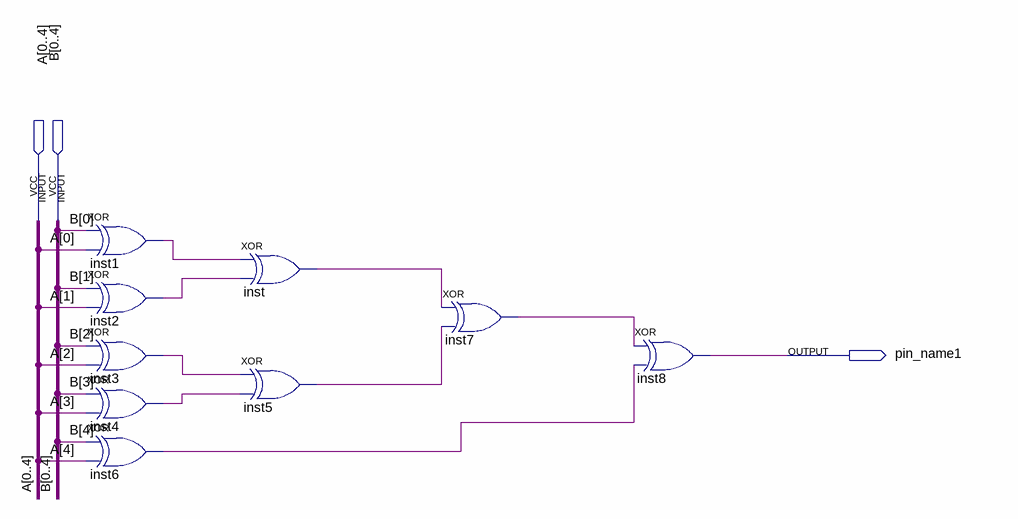
[diagram p0: schematic sheet]
// Quartus schematic AXORB.bdf as structural Verilog: 9 symbols, 3 pins
module AXORB (
  input  [0:4] A,
  input  [0:4] B,
  output pin_name1
);

  wire inst1_out, inst2_out, inst3_out, inst4_out, inst5_out, inst6_out, inst7_out, inst_out;

  xor inst1 (inst1_out, B[0], A[0]);
  xor inst2 (inst2_out, B[1], A[1]);
  xor inst3 (inst3_out, B[2], A[2]);
  xor inst4 (inst4_out, B[3], A[3]);
  xor inst6 (inst6_out, B[4], A[4]);
  xor inst (inst_out, inst1_out, inst2_out);
  xor inst5 (inst5_out, inst3_out, inst4_out);
  xor inst7 (inst7_out, inst_out, inst5_out);
  xor inst8 (pin_name1, inst7_out, inst6_out);
endmodule
